# Altium schematic sheet LED_Interface.SchDoc
size A4; SheetNumber: 2; SheetTotal: 2
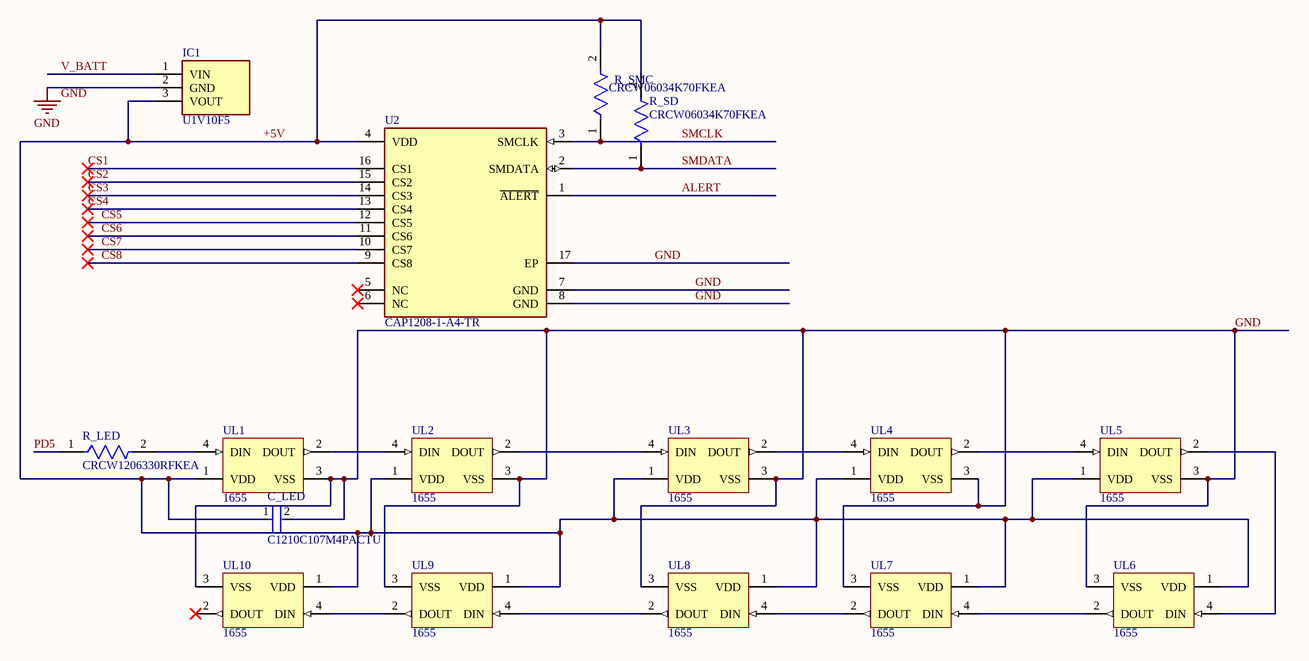
[diagram p0: LED_Interface.SchDoc]

## Parts
C_LED  C1210C107M4PACTU  [FP-C1210C-FS-MFG]
IC1  U1V10F5  [U1V10F5]
R_LED  CRCW1206330RFKEA  [FP-CRCW1206-e3-IPC_A]
R_SD  CRCW06034K70FKEA  [FP-CRCW0603-e3-IPC_A]
R_SMC  CRCW06034K70FKEA  [FP-CRCW0603-e3-IPC_A]
U2  CAP1208-1-A4-TR  [FP-CAP1208-1-A4-TR-MFG]
UL1  1655  [ADA-RGB-1655_V]
UL2  1655  [ADA-RGB-1655_V]
UL3  1655  [ADA-RGB-1655_V]
UL4  1655  [ADA-RGB-1655_V]
UL5  1655  [ADA-RGB-1655_V]
UL6  1655  [ADA-RGB-1655_V]
UL7  1655  [ADA-RGB-1655_V]
UL8  1655  [ADA-RGB-1655_V]
UL9  1655  [ADA-RGB-1655_V]
UL10  1655  [ADA-RGB-1655_V]

## Nets
GND: C_LED.2 IC1.2(GND) U2.7(GND) U2.8(GND) U2.17(EP) UL1.3(VSS) UL2.3(VSS) UL3.3(VSS) UL4.3(VSS) UL5.3(VSS) UL6.3(VSS) UL7.3(VSS) UL8.3(VSS) UL9.3(VSS) UL10.3(VSS)
+5V: C_LED.1 IC1.3(VOUT) R_SD.2 R_SMC.2 U2.4(VDD) UL1.1(VDD) UL2.1(VDD) UL3.1(VDD) UL4.1(VDD) UL5.1(VDD) UL6.1(VDD) UL7.1(VDD) UL8.1(VDD) UL9.1(VDD) UL10.1(VDD)
ALERT: U2.1(~{ALERT})
CS1: U2.16(CS1)
CS2: U2.15(CS2)
CS3: U2.14(CS3)
CS4: U2.13(CS4)
CS5: U2.12(CS5)
CS6: U2.11(CS6)
CS7: U2.10(CS7)
CS8: U2.9(CS8)
PD5: R_LED.1
SMCLK: R_SMC.1 U2.3(SMCLK)
SMDATA: R_SD.1 U2.2(SMDATA)
V_BATT: IC1.1(VIN)
NetR_LED_2: R_LED.2 UL1.4(DIN)
NetUL1_2: UL1.2(DOUT) UL2.4(DIN)
NetUL2_2: UL2.2(DOUT) UL3.4(DIN)
NetUL3_2: UL3.2(DOUT) UL4.4(DIN)
NetUL4_2: UL4.2(DOUT) UL5.4(DIN)
NetUL5_2: UL5.2(DOUT) UL6.4(DIN)
NetUL6_2: UL6.2(DOUT) UL7.4(DIN)
NetUL7_2: UL7.2(DOUT) UL8.4(DIN)
NetUL8_2: UL8.2(DOUT) UL9.4(DIN)
NetUL9_2: UL9.2(DOUT) UL10.4(DIN)

Not connected (* = marked no-connect by the designer): U2 5(NC)* 6(NC)*; UL10 2(DOUT)*

## Notes on the sheet
- Labels drawn without touching a wire or pin: GND

## Library data of the parts
C_LED = CMP-03020-034653-1: CAP CER 100UF 16V X5R 1210; Tolerance: 20%; Dielectric Material: Ceramic; Max Operating Temperature: 85°C; REACH SVHC: No SVHC; Case Code (Metric): 3225; Case/Package: 1210; Thickness: 0.106inch; Length: 3.2mm; Min Operating Temperature: -55°C; Voltage Rating (DC): 16V; Weight: 0.000564oz; Packaging: Tape and Reel; Case Code (Imperial): 1210; Depth: 2.5mm; Lead Free: Lead Free; Width: 0.098inch; Voltage Rating: 16V; Capacitance: 100uF; Termination: SMD/SMT; Dielectric: X5R; Package Quantity: 1000
IC1 = U1V10F5: Integrated Circuit; Manufacturer_Name: Pololu; Datasheet Link: https://www.pololu.com/product/2564; Height: 2.72mm; Manufacturer_Part_Number: U1V10F5
R_LED = CMP-2003-02098-2: RES Thick Film, 330Ω, 1%, 0.25W, 100ppm/°C, 1206; Voltage Rating: 200V; Resistance: 330R; Max Power Dissipation: 250mW; Height: 0.55mm; Mount: Surface Mount; Min Operating Temperature: -55°C; Depth: 1.6mm; Features: Automotive AEC-Q200; Voltage Rating (DC): 200V; Military Standard: Not; Packaging: Tape and Reel; Composition: Thick Film; Contact Plating: Tin; Case Code (Imperial): 1206; Case/Package: 1206; Number of Terminations: 2; Length: 3.2mm; Lead Free: Lead Free; Tolerance: 1%; Temperature Coefficient: 100ppm/°C; Case Code (Metric): 3216; Width: 1.6mm; Weight: 0.000353oz; Termination: SMD/SMT; Radiation Hardening: No; Package Quantity: 10; Power Rating: 250mW; Max Operating Temperature: 155°C
R_SD R_SMC = CMP-1666-00019-3: RES Thick Film, 4.7kΩ, 1%, 0.1W, 100ppm/°C, 0603; Resistance: 4.7kR; Voltage Rating: 75V; Power Rating: 100mW; Case Code (Metric): 1608; Military Standard: Not; Packaging: Tape and Reel; Termination: SMD/SMT; Temperature Coefficient: 100ppm/°C; Lead Free: Lead Free; Length: 1.55mm; Width: 0.85mm; Height: 0.45mm; Depth: 0.85mm; Weight: 7.1E-05oz; Case Code (Imperial): 0603; Contact Plating: Tin; Case/Package: 0603; Max Operating Temperature: 155°C; Mount: Surface Mount; Tolerance: 1%; Min Operating Temperature: -55°C; Package Quantity: 5000; Voltage Rating (DC): 75V; Composition: Thick Film
U2 = CMP-06270-000011-1: IC TOUCH SENSOR CAP 8CH 16QFN; Touchscreen: Capacitive; Operating Supply Current: 500uA; Max Supply Voltage: 5.5V; Number of Channels: 8; Interface: I2C; Min Supply Voltage: 3V; Operating Supply Voltage: 5V; Case/Package: QFN; Packaging: Tape and Reel; Series: -; Mount: Surface Mount; RoHS Compliant: Yes; Width: 3mm; Number of Pins: 16; Min Operating Temperature: -40°C; Length: 3mm; REACH SVHC: No SVHC; Supply Current: 500uA; Max Operating Temperature: 125°C; Package Quantity: 5000; Number of Inputs: 8; Termination: SMD/SMT; Nominal Supply Current: 500uA
UL1-UL10 = CMP-2000-05026-1: Intelligent Control LED Integrated Light Source, 3.5 to 5.3 V, -25 to 80 degC, 4-Pin SMD, RoHS, Tape and Reel; Manufacturer: Adafruit-Industries-LLC; Number of LEDs: 10; Configuration: Discrete; Utilized LED: WS2812(5050); Datasheet URL: http://datasheet.octopart.com/ADA1655-Adafruit-Industries-datasheet-32028139.pdf; Series: Neopixel; Interface: -; Package Description: 4-Pin Surface Mount Device, Body 5 x 5 mm; Color: Red,Green,Blue(RGB); Category: Optoelectronics; Controller Type: -; Package Reference: 1655; Manufacturer URL: https://www.adafruit.com/; Mounting Type: SurfaceMount; Datasheet Version: May-13; Size / Dimension: 5.00mmLx5.00mmW; Family: Addressable,Specialty